# Altium schematic sheet PCB1.SchDoc
size A4; Parameter 1: 1K
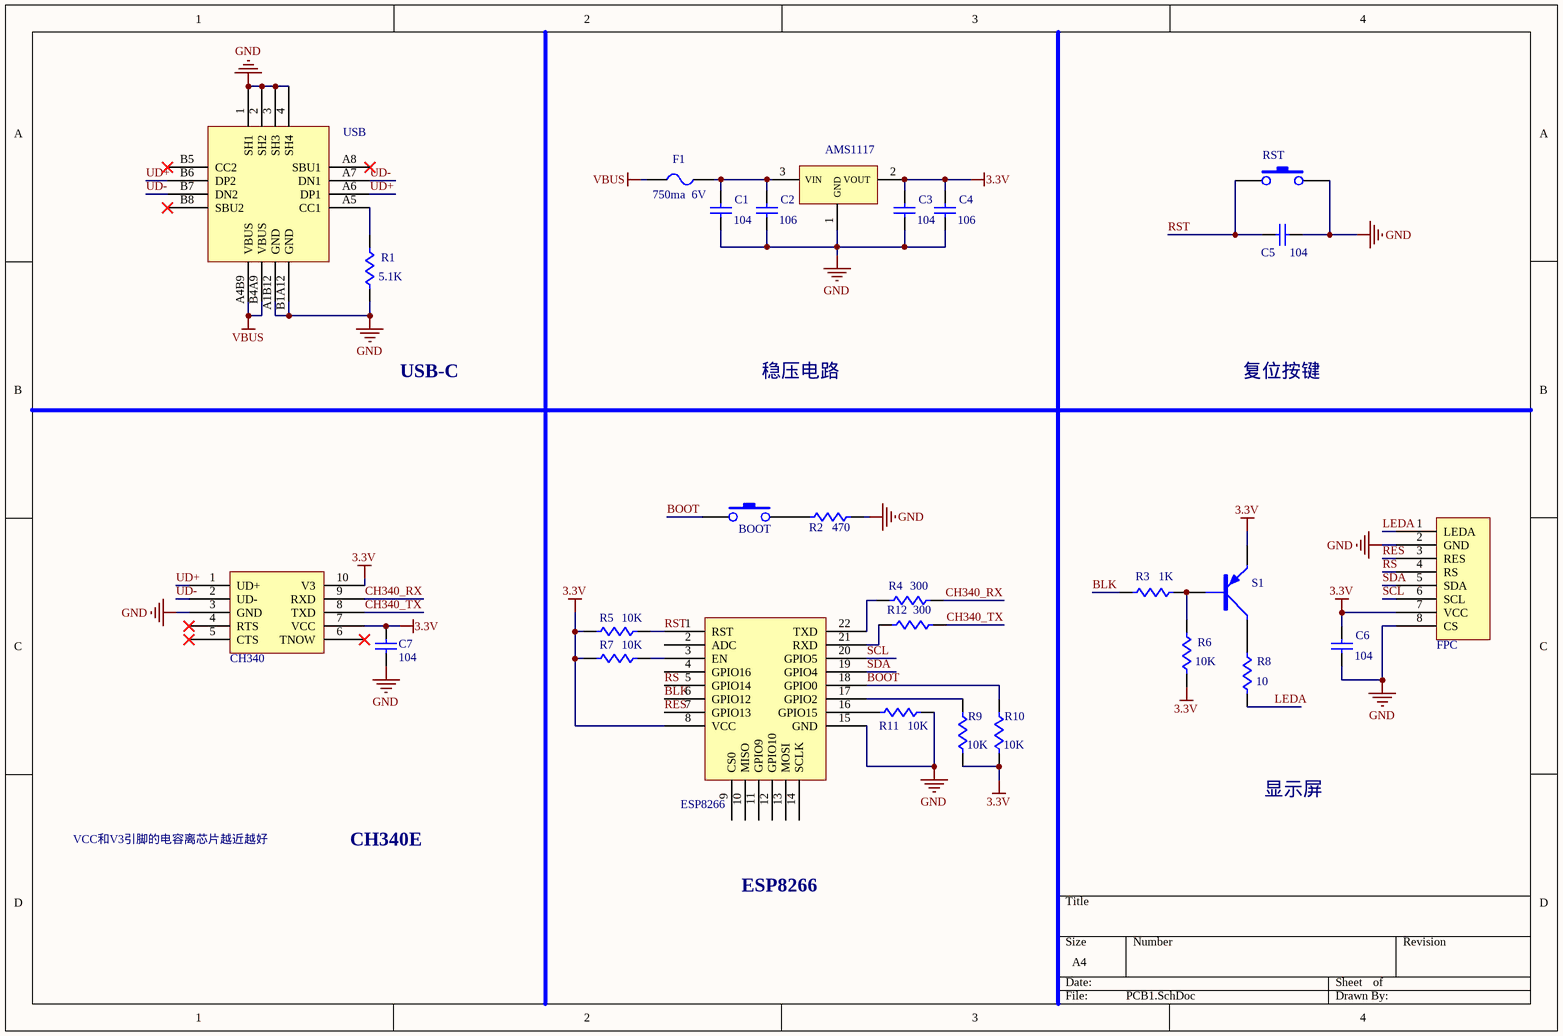
[diagram p0: PCB1.SchDoc]

## Parts
AMS1117  AMS-3V3  [SOT89-M]  (value not drawn)
BOOT  KEY3*4mm  [KEY3*4mm]  (value not drawn)
C1  value 104  [0603-C]  (hidden comment: CAP)
C2  value 106  [0603-C]  (hidden comment: CAP)
C3  value 104  [0603-C]  (hidden comment: CAP)
C4  value 106  [0603-C]  (hidden comment: CAP)
C5  value 104  [0603-C]  (hidden comment: CAP)
C6  value 104  [0603-C]  (hidden comment: CAP)
C7  value 104  [0603-C]  (hidden comment: CAP)
CH340  CH340E  [CH340E]  (value not drawn)
ESP8266  ESP8266-12F  [ESP8266-12F]  (value not drawn)
F1  750ma  6V  [PTC-0603]
FPC  FPC Connector  [FPC Connector]  (value not drawn)
R1  value 5.1K  [0603-R]  (hidden comment: RES)
R2  value 470  [0603-R]  (hidden comment: RES)
R3  value 1K  [0603-R]  (hidden comment: RES)
R4  value 300  [0603-R]  (hidden comment: RES)
R5  value 10K  [0603-R]  (hidden comment: RES)
R6  value 10K  [0603-R]  (hidden comment: RES)
R7  value 10K  [0603-R]  (hidden comment: RES)
R8  value 10  [0603-R]  (hidden comment: RES)
R9  value 10K  [0603-R]  (hidden comment: RES)
R10  value 10K  [0603-R]  (hidden comment: RES)
R11  value 10K  [0603-R]  (hidden comment: RES)
R12  value 300  [0603-R]  (hidden comment: RES)
RST  KEY3*4mm  [KEY3*4mm]  (value not drawn)
S1  S8550  [S8550]  (value not drawn)
USB  TYPE-C  [TYPE-C]  (value not drawn)

## Nets
3.3V: AMS1117.2(VOUT) C3.2 C4.2 C6.2 C7.1 CH340.7(VCC) CH340.10(V3) ESP8266.8(VCC) FPC.7(VCC) R5.2 R6.1 R7.2 R9.1 R10.2 S1.2(E)
GND: AMS1117.1(GND) C1.1 C2.1 C3.1 C4.1 C5.1 C6.1 C7.2 CH340.3(GND) ESP8266.15(GND) FPC.2(GND) FPC.8(CS) R1.1 R2.2 R11.1 RST.2 USB.1(SH1) USB.2(SH2) USB.3(SH3) USB.4(SH4) USB.A1B12(GND) USB.B1A12(GND)
VBUS: F1.1 USB.A4B9(VBUS) USB.B4A9(VBUS)
BLK: ESP8266.6(GPIO12) R3.2
BOOT: BOOT.1 ESP8266.18(GPIO0) R10.1
CH340_RX: CH340.9(RXD) R4.1
CH340_TX: CH340.8(TXD) R12.1
LEDA: FPC.1(LEDA) R8.1
RES: ESP8266.7(GPIO13) FPC.3(RES)
RS: ESP8266.5(GPIO14) FPC.4(RS)
RST: C5.2 ESP8266.1(RST) R5.1 RST.1
SCL: ESP8266.20(GPIO5) FPC.6(SCL)
SDA: ESP8266.19(GPIO4) FPC.5(SDA)
UD+: CH340.1(UD+) USB.A6(DP1) USB.B6(DP2)
UD-: CH340.2(UD-) USB.A7(DN1) USB.B7(DN2)
NetAMS1117_3: AMS1117.3(VIN) C1.2 C2.2 F1.2
NetBOOT_2: BOOT.2 R2.1
NetESP8266_3: ESP8266.3(EN) R7.1
NetESP8266_16: ESP8266.16(GPIO15) R11.2
NetESP8266_17: ESP8266.17(GPIO2) R9.2
NetESP8266_21: ESP8266.21(RXD) R12.2
NetESP8266_22: ESP8266.22(TXD) R4.2
NetR1_2: R1.2 USB.A5(CC1)
NetR3_1: R3.1 R6.2 S1.1(B)
NetR8_2: R8.2 S1.3(C)

Not connected (* = marked no-connect by the designer): CH340 4(RTS)* 5(CTS)* 6(TNOW)*; ESP8266 2(ADC) 4(GPIO16) 9(CS0) 10(MISO) 11(GPIO9) 12(GPIO10) 13(MOSI) 14(SCLK); USB A8(SBU1)* B5(CC2)* B8(SBU2)*

## Notes on the sheet
- USB-C
- 稳压电路
- 复位按键
- VCC和V3引脚的电容离芯片越近越好
- CH340E
- 显示屏
- ESP8266

## Library data of the parts
C1-C7 = CAP: 电容-0603
F1 = FU: 贴片保险丝
R1-R12 = RES: 电阻-0603